# Altium project radxa_c200_io_board_v1.11.PrjPcb (part 3 of 8)

## Sheet 08_Fan Debug and EEPROM.SchDoc: C200
size 439 x 311 mm; Page Create Date: March  8, 1995; Page Number: 8; Page Size: Custom; Comment: radxa_1010; Page Count: 21; RevCode: V1.11; Doc: 08_Fan Debug and EEPROM; DsnPath: D:\WMS\C200\CC122\对外\C200 V1.11.DSN; SchematicName: c200; PageName: 08_Fan Debug and EEPROM; PageSize: Custom; TopSchematic: True
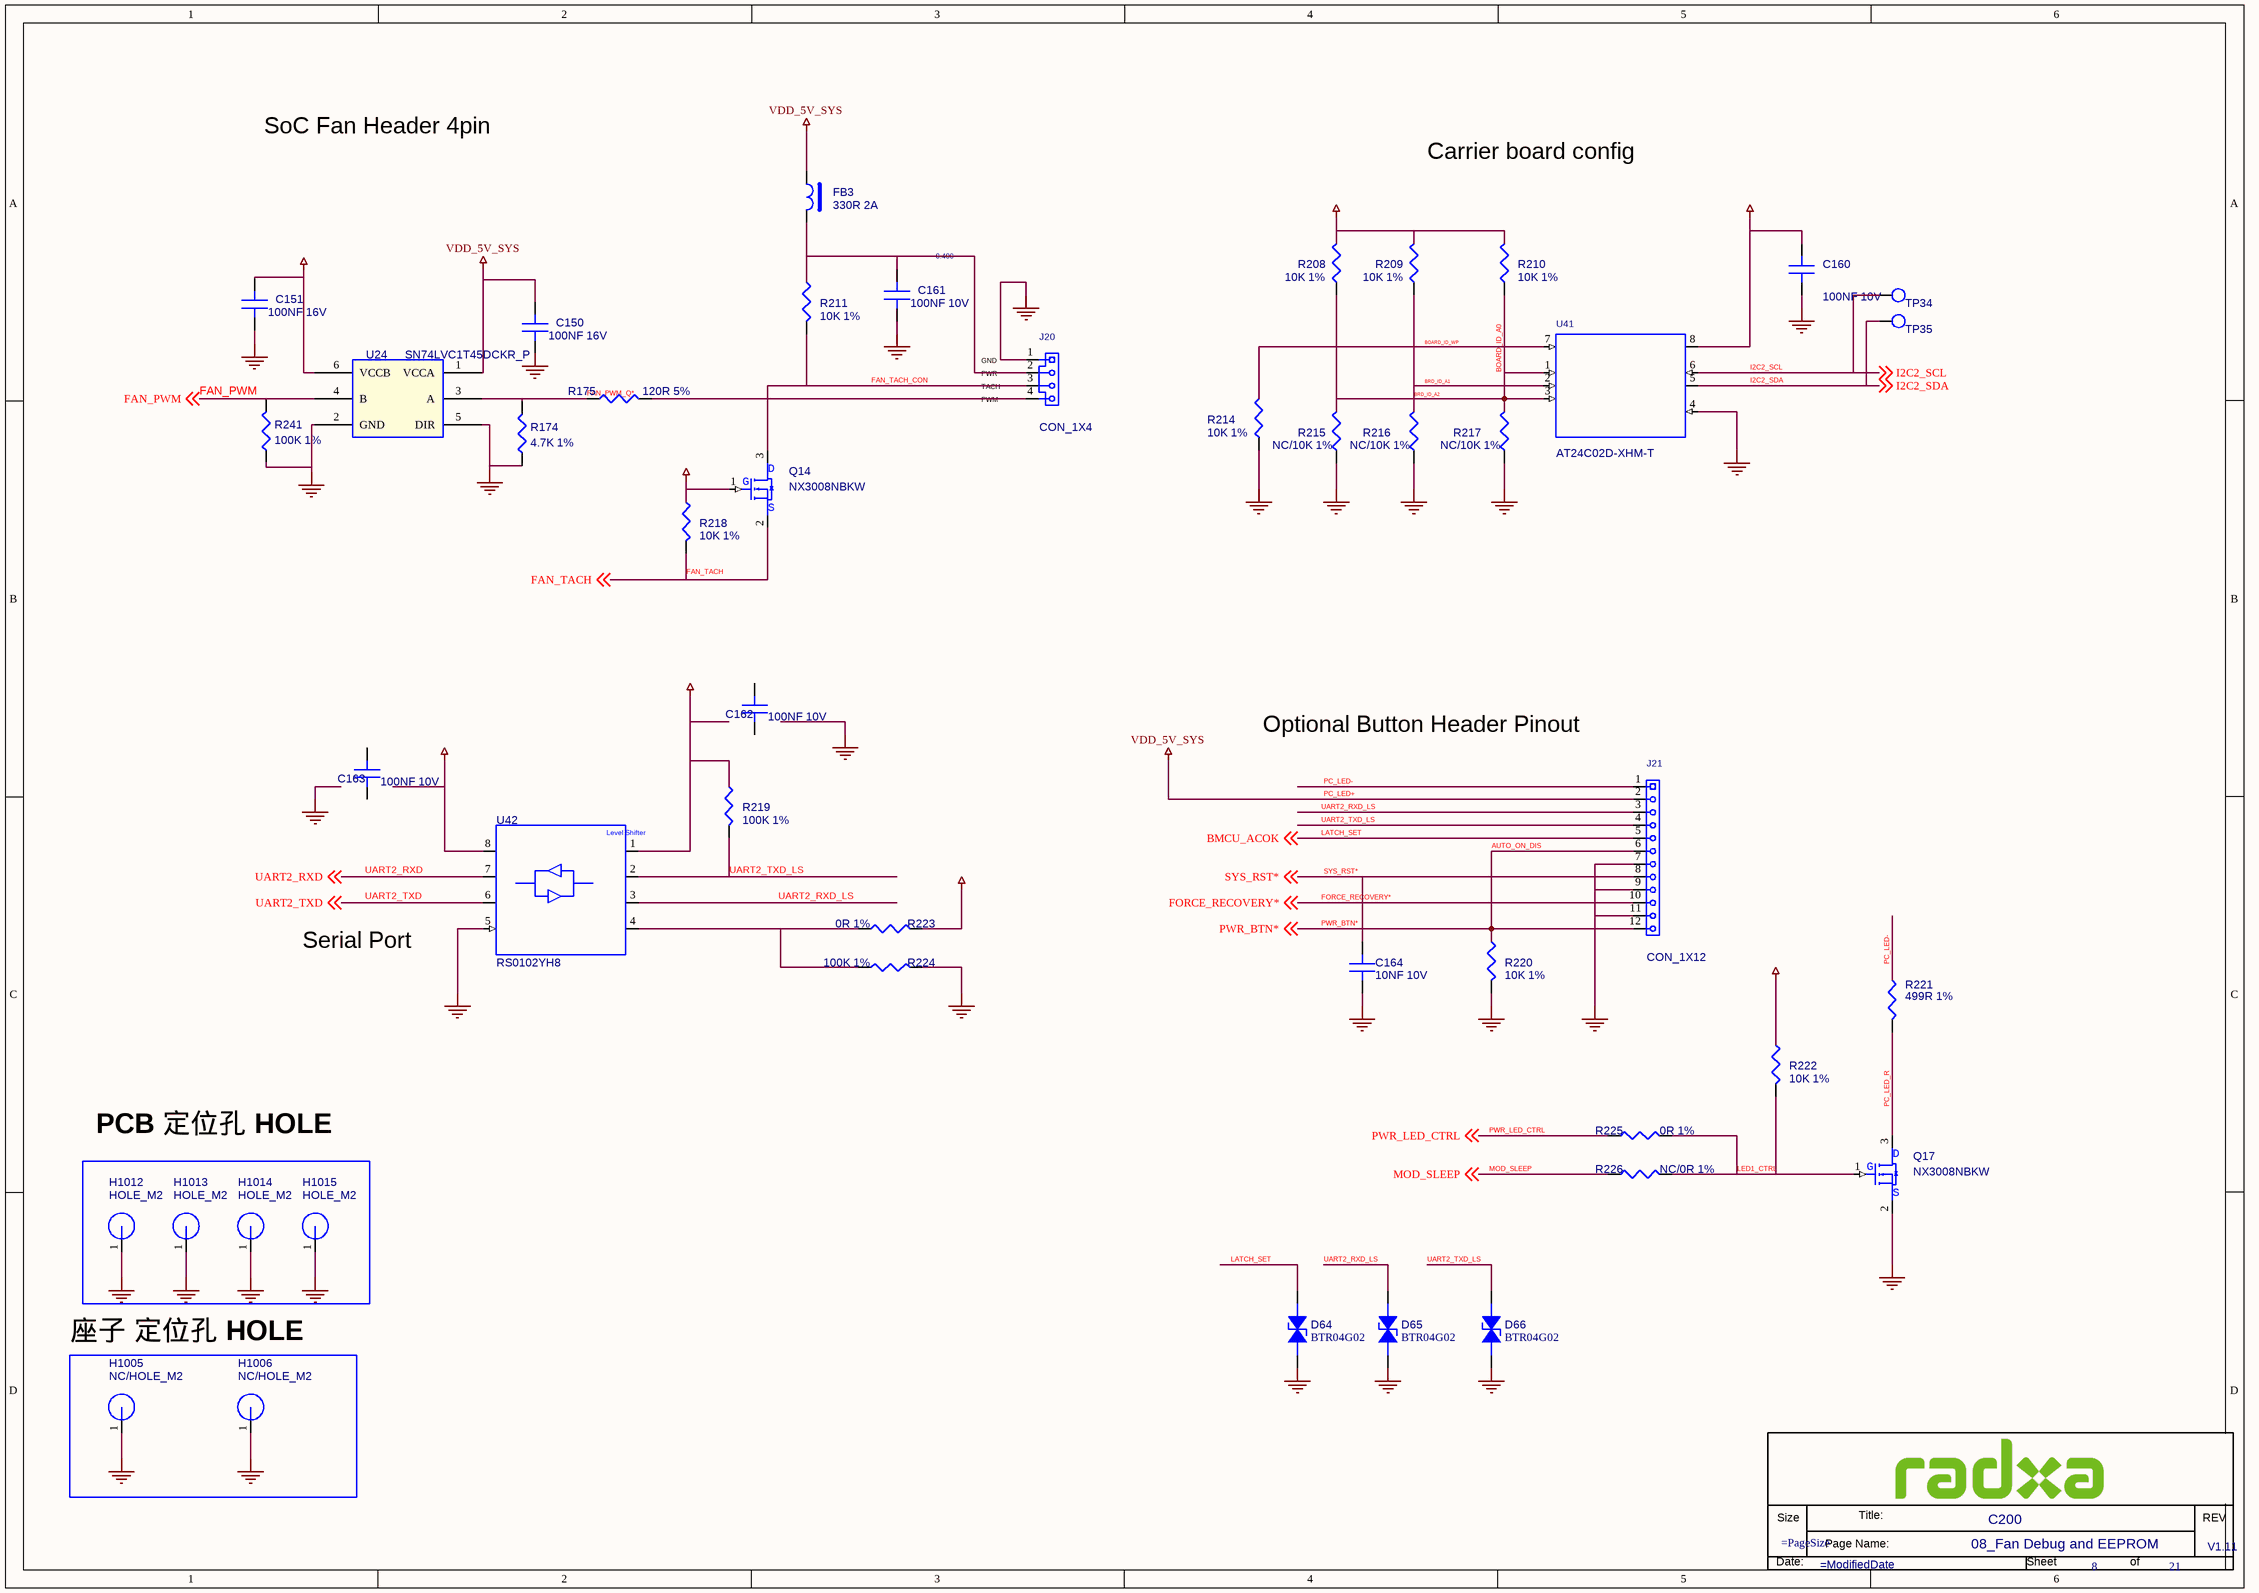
[diagram p17: 08_Fan Debug and EEPROM.SchDoc]

### Parts
(Parts that share a designator on the sheet are numbered #1, #2 ... from top to bottom, then left to right.)
*#7  Doc: 08_Fan Debug and EEPROM  RevCode: V1.11  Title: C200  Page Number: 8  Page Count: 21  (hidden comment: radxa_1010)  (graphical)
C150  100NF 16V  [C0201]
C151  100NF 16V  [C0201]
C160  100NF 10V  [C0402]
C161  100NF 10V  [C0402]
C162  100NF 10V  [C0402]
C163  100NF 10V  [C0402]
C164  10NF 10V  [C0201]
D64  BTR04G02  [DFN1006-2L]
D65  BTR04G02  [DFN1006-2L]
D66  BTR04G02  [DFN1006-2L]
FB3  330R 2A  [FB0603]
H1005  NC/HOLE_M2  [H3.8MM]
H1006  NC/HOLE_M2  [H3.8MM]
H1012  HOLE_M2  [H3.8MM]
H1013  HOLE_M2  [H3.8MM]
H1014  HOLE_M2  [H3.8MM]
H1015  HOLE_M2  [H3.8MM]
J20  CON_1X4  [CON_TH1X4_1D25_STA]
J21  CON_1X12  [CON_TH12X1_2D54_LIE]
Q14  NX3008NBKW  [SOT_323]
Q17  NX3008NBKW  [SOT_323]
R174  4.7K 1%  [R0402]
R175  120R 5%  [R0402]
R208  10K 1%  [R0402]
R209  10K 1%  [R0402]
R210  10K 1%  [R0402]
R211  10K 1%  [R0402]
R214  10K 1%  [R0402]
R215  NC/10K 1%  [R0402]
R216  NC/10K 1%  [R0402]
R217  NC/10K 1%  [R0402]
R218  10K 1%  [R0402]
R219  100K 1%  [R0402]
R220  10K 1%  [R0402]
R221  499R 1%  [R0402]
R222  10K 1%  [R0402]
R223  0R 1%  [R0402]
R224  100K 1%  [R0402]
R225  0R 1%  [R0402]
R226  NC/0R 1%  [R0402]
R241  100K 1%  [R0402]
TP34  DNI  [stp30]  (value not drawn)
TP35  DNI  [stp30]  (value not drawn)
U24  SN74LVC1T45DCKR_P  [SOT_363]
U41  AT24C02D-XHM-T  [DFN8_0D5_1D6]
U42  RS0102YH8  [SOT23_8]

### Blocks framed on the sheet
座子 定位孔 HOLE: H1005 H1006

### Nets
GND: C150.2(B) C151.2(B) C160.2(B) C161.2(B) C164.2(B) D64.1(ANODE) D65.1(ANODE) D66.1(ANODE) H1005.1 H1006.1 H1012.1 H1013.1 H1014.1 H1015.1 J20.1 J21.7 J21.9 J21.11 Q17.2(S) R174.1 R214.2 R215.2 R216.2 R217.2 R220.2 R224.1 R241.1 U24.2(GND) U24.5(DIR) U41.4(GND) U42.5(GND)  [project net HUB2_SSTX_N_J25]
PC_LED+: C150.1(A) FB3.1 J21.2 U24.1(VCCA)  [also labelled VDD_5V_SYS]
VDD_1V8: C151.1(A) C160.1(A) Q14.1(G) R208.1 R209.1 R210.1 R218.1 R222.1 R223.1 U24.6(VCCB) U41.8(VCC) U42.8(VCCA)
VDD_3V3_SYS: R219.1 U42.1(VCCB)  [project net 3V3]
AUTO_ON_DIS: J21.6 J21.12 R220.1 ; off-sheet PWR_BTN*  [also labelled PWR_BTN*]
BMCU_ACOK: D64.2(CATHODE) J21.5 ; off-sheet BMCU_ACOK  [also labelled LATCH_SET]
BOARD_ID_A0: R208.2 R209.2 R210.2 R215.1 R216.1 R217.1 U41.1(A0) U41.2(A1) U41.3(A2)  [also labelled BRD_ID_A1, BRD_ID_A2]
BOARD_ID_WP: R214.1 U41.7(WP)
FAN_PWM: R241.2 U24.4(B) ; off-sheet FAN_PWM
FAN_PWM_Q*: R174.2 R175.1 U24.3(A)
FAN_TACH: Q14.2(S) R218.2 ; off-sheet FAN_TACH
FAN_TACH_CON: J20.3 Q14.3(D) R211.2
FORCE_RECOVERY*: J21.10 ; off-sheet FORCE_RECOVERY*
I2C2_SCL: TP34.1 U41.6(SCL) ; off-sheet I2C2_SCL
I2C2_SDA: TP35.1 U41.5(SDA) ; off-sheet I2C2_SDA
LED1_CTRL: Q17.1(G) R222.2 R225.2 R226.2
MOD_SLEEP: R226.1 ; off-sheet MOD_SLEEP
PC_LED-: J21.1 R221.1
PC_LED_R: Q17.3(D) R221.2
PWR_LED_CTRL: R225.1 ; off-sheet PWR_LED_CTRL
SYS_RST*: C164.1(A) J21.8 ; off-sheet SYS_RST*
UART2_RXD: U42.7(A1) ; off-sheet UART2_RXD
UART2_RXD_LS: D65.2(CATHODE) J21.3 U42.3(B2)
UART2_TXD: U42.6(A2) ; off-sheet UART2_TXD
UART2_TXD_LS: D66.2(CATHODE) J21.4 R219.2 U42.2(B1)
NetC161_1: C161.1(A) FB3.2 J20.2 R211.1
NetJ20_4: J20.4 R175.2
NetR223_2: R223.2 R224.2 U42.4(OE)

Not connected (* = marked no-connect by the designer): C162 1(A) 2(B); C163 1(A) 2(B)

### Notes on the sheet
- SoC Fan Header 4pin
- Carrier board config
- (near C161) 0.400
- (near J20) PWR
- (near J20) GND
- (near J20) PWM
- (near J20) TACH
- Optional Button Header Pinout
- Serial Port
- PCB 定位孔 HOLE
- (in symbol radxa_1010) Size; Title:; REV; Page Name:; Date:; Sheet; of

### Library data of the parts
C150 = C: SMD  0201  100NF  16V  X5R  ±10%  ROHS; PARTS: 1; Part Reference: C150; Part Number: A1C01.00018; OriginalSymbolOrigin: (0,30); PKG_TYPE: CAP2-100-250; LEVEL: STD; PINSWAP: (A,B); Preferred: 6715f349cd0bc5; Value: 100NF 16V; Part Type: 陶瓷电容; PCB Footprint: C0201
C151 = C: SMD  0201  100NF  16V  X5R  ±10%  ROHS; PARTS: 1; Part Reference: C151; Part Number: A1C01.00018; OriginalSymbolOrigin: (0,30); PKG_TYPE: CAP2-100-250; LEVEL: STD; PINSWAP: (A,B); Preferred: 6715f349cd0bc5; Value: 100NF 16V; Part Type: 陶瓷电容; PCB Footprint: C0201
C160 = C: SMD  0402  100NF  10V  X5R  ±10%  ROHS; PARTS: 1; Part Reference: C160; Part Number: A1C01.00163; OriginalSymbolOrigin: (0,30); PKG_TYPE: CAP2-100-250; LEVEL: STD; PINSWAP: (A,B); Value: 100NF 10V; Part Type: 陶瓷电容; PCB Footprint: C0402
C161 = C: SMD  0402  100NF  10V  X5R  ±10%  ROHS; PARTS: 1; Part Reference: C161; Part Number: A1C01.00163; OriginalSymbolOrigin: (0,30); PKG_TYPE: CAP2-100-250; LEVEL: STD; PINSWAP: (A,B); Value: 100NF 10V; Part Type: 陶瓷电容; PCB Footprint: C0402
C162 = C: SMD  0402  100NF  10V  X5R  ±10%  ROHS; PARTS: 1; Part Reference: C162; CDS_PART_NAME: C_0402-0.1UF,X5R,10%,6.3V,039-0007-000; CDS_PHYS_PART_NAME: C_0402-0.1UF,X5R,10%,6.3V,039-0007-000-0.1UF,039-0007-000; Part Number: A1C01.00163; OriginalSymbolOrigin: (0,30); PKG_TYPE: CAP2-100-250; LEVEL: STD; PINSWAP: (A,B); ASSEMBLY: DEBUG; CDS_LIB: discrete; DEVICE_TYPENAME: C_0402-01UFX5R1063V039-0007-000-01UF039-0007-000; DRAWING: @P3449_B01_LIB.P3449_B01(SCH_1):PAGE20; MAX_VOLTAGE: 6.3V; NV_PN: 039-0007-000; PACK_TYPE: 402; PATH: I307; PHYS_PAGE: 20; ROT: 0; SIGNAL_MODEL: nv_cap; VER: 2; XY: (-8050,2950); Value: 100NF 10V; CDS_SEC: 1; CHIPS_PART_NAME: C; MAT: X5R; TOL: 10%; SEC: 1; Part Type: 陶瓷电容; PCB Footprint: C0402
C163 = C: SMD  0402  100NF  10V  X5R  ±10%  ROHS; PARTS: 1; Part Reference: C163; CDS_PART_NAME: C_0402-0.1UF,X5R,10%,6.3V,039-0007-000; CDS_PHYS_PART_NAME: C_0402-0.1UF,X5R,10%,6.3V,039-0007-000-0.1UF,039-0007-000; Part Number: A1C01.00163; OriginalSymbolOrigin: (0,30); PKG_TYPE: CAP2-100-250; LEVEL: STD; PINSWAP: (A,B); ASSEMBLY: DEBUG; CDS_LIB: discrete; DEVICE_TYPENAME: C_0402-01UFX5R1063V039-0007-000-01UF039-0007-000; DRAWING: @P3449_B01_LIB.P3449_B01(SCH_1):PAGE20; MAX_VOLTAGE: 6.3V; NV_PN: 039-0007-000; PACK_TYPE: 402; PATH: I309; PHYS_PAGE: 20; ROT: 0; SIGNAL_MODEL: nv_cap; VER: 2; XY: (-9550,2700); Value: 100NF 10V; CDS_SEC: 1; CHIPS_PART_NAME: C; MAT: X5R; TOL: 10%; SEC: 1; Part Type: 陶瓷电容; PCB Footprint: C0402
C164 = C: SMD  0201  10NF  10V  X5R  ±20%  ROHS; PARTS: 1; Part Reference: C164; Part Number: A1C01.00095; OriginalSymbolOrigin: (0,30); PKG_TYPE: CAP2-100-250; LEVEL: STD; PINSWAP: (A,B); Value: 10NF 10V; Part Type: 陶瓷电容; PCB Footprint: C0201
D64 = ESD: SMD  编带  0402  BTR04G02  B-tron  ROHS; Part Reference: D64; Part Number: A1D02.00002; Parameter: ESD-台舟 ESD5341N-封装 esd0402; ID: DE-E0004; Temp Coeff: -50℃ ~ +125℃; PCB Footprint: ESD_D0402; Value: BTR04G02; Part Type: 二极管-ESD管-桥堆-TVS管
D65 = ESD: SMD  编带  0402  BTR04G02  B-tron  ROHS; Part Reference: D65; Part Number: A1D02.00002; Parameter: ESD-台舟 ESD5341N-封装 esd0402; ID: DE-E0004; Temp Coeff: -50℃ ~ +125℃; PCB Footprint: ESD_D0402; Value: BTR04G02; Part Type: 二极管-ESD管-桥堆-TVS管
D66 = ESD: SMD  编带  0402  BTR04G02  B-tron  ROHS; Part Reference: D66; Part Number: A1D02.00002; Parameter: ESD-台舟 ESD5341N-封装 esd0402; ID: DE-E0004; Temp Coeff: -50℃ ~ +125℃; PCB Footprint: ESD_D0402; Value: BTR04G02; Part Type: 二极管-ESD管-桥堆-TVS管
FB3 = BEAD: SMD  0603  FB330R  2A  ±25%  ROHS; Part Reference: FB3; Part Number: A1L09.00023; PCB Footprint: FB0603; Value: 330R 2A; Part Type: 贴片磁珠
H1005 = HOLE: Part Reference: H1005; PCB Footprint: HOLE_C6_0D3_5MM; RK PN: HOLE_3R50; Priority: A; Value: NC/HOLE_M2; Part Type: HOLE
H1006 = HOLE: Part Reference: H1006; PCB Footprint: HOLE_C6_0D3_5MM; RK PN: HOLE_3R50; Priority: A; Value: NC/HOLE_M2; Part Type: HOLE
H1012 = HOLE: Part Reference: H1012; PCB Footprint: HOLE_C6_2D2_75MM; Priority: A; RK PN: HOLE_3R50; Value: HOLE_M2; Part Type: HOLE
H1013 = HOLE: Part Reference: H1013; PCB Footprint: HOLE_C6_2D2_75MM; Priority: A; RK PN: HOLE_3R50; Value: HOLE_M2; Part Type: HOLE
H1014 = HOLE: Part Reference: H1014; PCB Footprint: HOLE_C6_2D2_75MM; RK PN: HOLE_3R50; Priority: A; Value: HOLE_M2; Part Type: HOLE
H1015 = HOLE: Part Reference: H1015; PCB Footprint: HOLE_C6_2D2_75MM; RK PN: HOLE_3R50; Priority: A; Value: HOLE_M2; Part Type: HOLE
J20 = CON_1X4: DIP  母座  1*4PIN  90度  直脚  1.25mm脚距  5001-WF0125C-04P1-00  白色   文章济美  ROHS; Part Reference: J20; Part Number: A1J01.00077; OriginalSymbolOrigin: (-50,50); ANGLE: ?; ASSEMBLY: ?; GENDER: ?; LATCHING: ?; MAX_CURRENT: ?; MAX_VOLTAGE: ?; NV_NAME: ?; NV_PN: ?; PACK_TYPE: ?; PATH: ?; PITCH: ?; PLACEMENT_NOTE: ?; REFLOW: ?; SHROUDED: ?; SKU: COMMON; Value: CON_1X4; Part Type: 连接座; PCB Footprint: CON_TH1X4_1D25_STA
J21 = CON_1X12: DIP  排针座  1*12PIN  90度  弯角  2.54mm脚距  L=13.8/3.0(1.2)/6.0  PA6T  国意英  ROHS; Part Reference: J21; Part Number: A1J02.00035; OriginalSymbolOrigin: (0,300); ANGLE: ?; ASSEMBLY: ?; GENDER: ?; LATCHING: ?; MAX_CURRENT: ?; MAX_VOLTAGE: ?; NV_NAME: ?; NV_PN: ?; PACK_TYPE: ?; PATH: ?; PITCH: ?; PLACEMENT_NOTE: ?; REFLOW: ?; SHROUDED: ?; SKU: COMMON; Value: CON_1X12; Part Type: 排座; PCB Footprint: CON_TH12X1_2D54_LIE
Q14 = MOSFET_NPN: SMD  编带  SOT-323  NX3008NBKW  N沟道  Nexperia(安世)  ROHS; Part Reference: Q14; Part Number: A1D01.00070; Temp Coeff: -55℃ to ＋150℃; Value: NX3008NBKW; Part Type: 三极管-MOS管; PCB Footprint: SOT_323
Q17 = MOSFET_NPN: SMD  编带  SOT-323  NX3008NBKW  N沟道  Nexperia(安世)  ROHS; Part Reference: Q17; Part Number: A1D01.00070; Temp Coeff: -55℃ to ＋150℃; Value: NX3008NBKW; Part Type: 三极管-MOS管; PCB Footprint: SOT_323
R174 = R: SMD  0201  4.7K  1/20W  ±1%  ROHS; Part Reference: R174; Part Number: A1R01.00148; PCB Footprint: R0201; Preferred: 6715f349cd0bc5; Value: 4.7K 1%; Part Type: 贴片电阻
R175 = R: SMD  0402  120R  1/16W  ±5%  ROHS; Part Reference: R175; Part Number: A1R01.00275; Preferred: 6715f349cd0bc5; PCB Footprint: R0402; Value: 120R 5%; Part Type: 贴片电阻
R208 = R: SMD  0402  10K  1/16W  ±1%  ROHS; Part Reference: R208; CDS_PART_NAME: R_0402-10K,5 %,62.5MW,195-0486-000; CDS_PHYS_PART_NAME: R_0402-10K,5 %,62.5MW,195-0486-000-10K,195-0486-000; Part Number: A1R01.00222; ASSEMBLY: L4T_EEPROM; CDS_LIB: discrete; CDS_SEC: 1; DEVICE_TYPENAME: R_0402-10K5625MW195-0486-000-10K195-0486-000; DRAWING: @P3449_B01_LIB.P3449_B01(SCH_1):PAGE20; MAX_WATTAGE: 62.5mW; NV_PN: 195-0486-000; PACK_TYPE: 402; PATH: I346; PHYS_PAGE: 20; ROT: 2; SIGNAL_MODEL: nv_res; TOL: 5%; XY: (-4100,6200); PCB Footprint: R0402; Value: 10K 1%; CHIPS_PART_NAME: R; SEC_TYPE: 402; VER: 2; SEC: 1; Part Type: 贴片电阻
R209 = R: SMD  0402  10K  1/16W  ±1%  ROHS; Part Reference: R209; CDS_PART_NAME: R_0402-10K,5 %,62.5MW,195-0486-000; CDS_PHYS_PART_NAME: R_0402-10K,5 %,62.5MW,195-0486-000-10K,195-0486-000; Part Number: A1R01.00222; ASSEMBLY: L4T_EEPROM; CDS_LIB: discrete; CDS_SEC: 1; DEVICE_TYPENAME: R_0402-10K5625MW195-0486-000-10K195-0486-000; DRAWING: @P3449_B01_LIB.P3449_B01(SCH_1):PAGE20; MAX_WATTAGE: 62.5mW; NV_PN: 195-0486-000; PACK_TYPE: 402; PATH: I344; PHYS_PAGE: 20; ROT: 2; SIGNAL_MODEL: nv_res; TOL: 5%; XY: (-3800,6200); PCB Footprint: R0402; Value: 10K 1%; CHIPS_PART_NAME: R; SEC_TYPE: 402; VER: 2; SEC: 1; Part Type: 贴片电阻
R210 = R: SMD  0402  10K  1/16W  ±1%  ROHS; Part Reference: R210; Part Number: A1R01.00222; CDS_PHYS_PART_NAME: R_0402-10K,5 %,62.5MW,195-0486-000-10K,195-0486-000; CDS_PART_NAME: R_0402-10K,5 %,62.5MW,195-0486-000; SEC: 1; XY: (-3450,6200); VER: 2; TOL: 5%; SIGNAL_MODEL: nv_res; SEC_TYPE: 402; PHYS_PAGE: 20; PATH: I343; NV_PN: 195-0486-000; MAX_WATTAGE: 62.5mW; DRAWING: @P3449_B01_LIB.P3449_B01(SCH_1):PAGE20; DEVICE_TYPENAME: R_0402-10K5625MW195-0486-000-10K195-0486-000; CDS_LIB: discrete; ASSEMBLY: L4T_EEPROM; PCB Footprint: R0402; Value: 10K 1%; Part Type: 贴片电阻; ROT: 2; PACK_TYPE: 402; CHIPS_PART_NAME: R; CDS_SEC: 1
R211 = R: SMD  0402  10K  1/16W  ±1%  ROHS; Part Reference: R211; CDS_PART_NAME: R_0402-10K,5 %,62.5MW,195-0486-000; CDS_PHYS_PART_NAME: R_0402-10K,5 %,62.5MW,195-0486-000-10K,195-0486-000; Part Number: A1R01.00222; ASSEMBLY: FAN; CDS_LIB: discrete; CDS_SEC: 1; DEVICE_TYPENAME: R_0402-10K5625MW195-0486-000-10K195-0486-000; DRAWING: @P3449_B01_LIB.P3449_B01(SCH_1):PAGE20; MAX_WATTAGE: 62.5mW; NV_PN: 195-0486-000; PACK_TYPE: 402; PATH: I372; PHYS_PAGE: 20; ROT: 0; SIGNAL_MODEL: nv_res; TOL: 5%; VER: 2; XY: (-8350,5950); PCB Footprint: R0402; Value: 10K 1%; CHIPS_PART_NAME: R; SEC: 1; Part Type: 贴片电阻
R214 = R: SMD  0402  10K  1/16W  ±1%  ROHS; Part Reference: R214; CDS_PART_NAME: R_0402-10K,5 %,62.5MW,195-0486-000; CDS_PHYS_PART_NAME: R_0402-10K,5 %,62.5MW,195-0486-000-10K,195-0486-000; Part Number: A1R01.00222; ASSEMBLY: L4T_EEPROM; CDS_LIB: discrete; CDS_SEC: 1; DEVICE_TYPENAME: R_0402-10K5625MW195-0486-000-10K195-0486-000; DRAWING: @P3449_B01_LIB.P3449_B01(SCH_1):PAGE20; MAX_WATTAGE: 62.5mW; NV_PN: 195-0486-000; PACK_TYPE: 402; PATH: I350; PHYS_PAGE: 20; ROT: 2; SIGNAL_MODEL: nv_res; TOL: 5%; XY: (-4400,5600); PCB Footprint: R0402; Value: 10K 1%; CHIPS_PART_NAME: R; SEC_TYPE: 402; VER: 2; SEC: 1; Part Type: 贴片电阻
R215 = R: SMD  0402  10K  1/16W  ±1%  ROHS; Part Reference: R215; Part Number: A1R01.00222; CDS_PHYS_PART_NAME: R_0402-10K,5 %,62.5MW,195-0486-000-10K,195-0486-000; CDS_PART_NAME: R_0402-10K,5 %,62.5MW,195-0486-000; SEC: 1; XY: (-4100,5550); VER: 2; TOL: 5%; SIGNAL_MODEL: nv_res; PHYS_PAGE: 20; PATH: I375; PACK_TYPE: 402; NV_PN: 195-0486-000; MAX_WATTAGE: 62.5mW; DRAWING: @P3449_B01_LIB.P3449_B01(SCH_1):PAGE20; DEVICE_TYPENAME: R_0402-10K5625MW195-0486-000-10K195-0486-000; CDS_LIB: discrete; ASSEMBLY: L4T_EEPROM; PCB Footprint: R0402; Value: NC/10K 1%; Part Type: 贴片电阻; SKU: NO STUFF; ROT: 2; CHIPS_PART_NAME: R; CDS_SEC: 1
R216 = R: SMD  0402  10K  1/16W  ±1%  ROHS; Part Reference: R216; Part Number: A1R01.00222; CDS_PHYS_PART_NAME: R_0402-10K,5 %,62.5MW,195-0486-000-10K,195-0486-000; CDS_PART_NAME: R_0402-10K,5 %,62.5MW,195-0486-000; SEC: 1; XY: (-3800,5550); VER: 2; TOL: 5%; SIGNAL_MODEL: nv_res; PHYS_PAGE: 20; PATH: I374; PACK_TYPE: 402; NV_PN: 195-0486-000; MAX_WATTAGE: 62.5mW; DRAWING: @P3449_B01_LIB.P3449_B01(SCH_1):PAGE20; DEVICE_TYPENAME: R_0402-10K5625MW195-0486-000-10K195-0486-000; CDS_LIB: discrete; ASSEMBLY: L4T_EEPROM; PCB Footprint: R0402; Value: NC/10K 1%; Part Type: 贴片电阻; SKU: NO STUFF; ROT: 2; CHIPS_PART_NAME: R; CDS_SEC: 1
R217 = R: SMD  0402  10K  1/16W  ±1%  ROHS; Part Reference: R217; Part Number: A1R01.00222; CDS_PHYS_PART_NAME: R_0402-10K,5 %,62.5MW,195-0486-000-10K,195-0486-000; CDS_PART_NAME: R_0402-10K,5 %,62.5MW,195-0486-000; SEC: 1; XY: (-3450,5550); VER: 2; TOL: 5%; SIGNAL_MODEL: nv_res; SEC_TYPE: 402; PHYS_PAGE: 20; PATH: I348; NV_PN: 195-0486-000; MAX_WATTAGE: 62.5mW; DRAWING: @P3449_B01_LIB.P3449_B01(SCH_1):PAGE20; DEVICE_TYPENAME: R_0402-10K5625MW195-0486-000-10K195-0486-000; CDS_LIB: discrete; ASSEMBLY: L4T_EEPROM; PCB Footprint: R0402; Value: NC/10K 1%; Part Type: 贴片电阻; SKU: NO STUFF; ROT: 2; PACK_TYPE: 402; CHIPS_PART_NAME: R; CDS_SEC: 1
R218 = R: SMD  0402  10K  1/16W  ±1%  ROHS; Part Reference: R218; Part Number: A1R01.00222; CDS_PHYS_PART_NAME: R_0402-10K,5 %,62.5MW,195-0486-000-10K,195-0486-000; CDS_PART_NAME: R_0402-10K,5 %,62.5MW,195-0486-000; SEC: 1; XY: (-9150,4600); VER: 2; TOL: 5%; SIGNAL_MODEL: nv_res; ROT: 0; PHYS_PAGE: 20; PATH: I370; PACK_TYPE: 402; NV_PN: 195-0486-000; MAX_WATTAGE: 62.5mW; DRAWING: @P3449_B01_LIB.P3449_B01(SCH_1):PAGE20; DEVICE_TYPENAME: R_0402-10K5625MW195-0486-000-10K195-0486-000; CDS_LIB: discrete; ASSEMBLY: FAN; PCB Footprint: R0402; Value: 10K 1%; Part Type: 贴片电阻; CHIPS_PART_NAME: R; CDS_SEC: 1
R219 = R: SMD  0402  100K  1/16W  ±1%  ROHS; Part Reference: R219; Part Number: A1R01.00031; CDS_PHYS_PART_NAME: R_0402-100K,1 %,62.5MW,195-0005-000-100K,195-0005-000; CDS_PART_NAME: R_0402-100K,1 %,62.5MW,195-0005-000; Temp Coeff: －55℃ ~ ＋155℃; SEC: 1; XY: (-8150,2600); VER: 2; SIGNAL_MODEL: nv_res; ROT: 0; PHYS_PAGE: 20; PATH: I367; PACK_TYPE: 402; NV_PN: 195-0005-000; MAX_WATTAGE: 62.5mW; DRAWING: @P3449_B01_LIB.P3449_B01(SCH_1):PAGE20; DEVICE_TYPENAME: R_0402-100K1625MW195-0005-000-100K195-0005-000; CDS_LIB: discrete; ASSEMBLY: DEBUG; PCB Footprint: R0402; Value: 100K 1%; Part Type: 贴片电阻; TOL: 1%; CHIPS_PART_NAME: R; CDS_SEC: 1
R220 = R: SMD  0402  10K  1/16W  ±1%  ROHS; Part Reference: R220; Part Number: A1R01.00222; CDS_PART_NAME: R_0402-10K,5 %,62.5MW,195-0486-000; CDS_PHYS_PART_NAME: R_0402-10K,5 %,62.5MW,195-0486-000-10K,195-0486-000; ASSEMBLY: AUTOMATION; CDS_LIB: discrete; CDS_SEC: 1; DEVICE_TYPENAME: R_0402-10K5625MW195-0486-000-10K195-0486-000; DRAWING: #NAME?; MAX_WATTAGE: 62.5mW; NV_PN: 195-0486-000; PACK_TYPE: 402; PATH: I97; PHYS_PAGE: 23; ROT: 0; SIGNAL_MODEL: nv_res; TOL: 5%; VER: 2; XY: (-3000,2800); PCB Footprint: R0402; Value: 10K 1%; Part Type: 贴片电阻; CHIPS_PART_NAME: R; SEC: 1
R221 = R: SMD  0402  499R  1/16W  ±1%  ROHS; Part Reference: R221; Part Number: A1R01.00308; CDS_PART_NAME: R_0402-499OHM,1 %,62.5MW,195-0338-000; CDS_PHYS_PART_NAME: R_0402-499OHM,1 %,62.5MW,195-0338-000-195-0338-000,499OHM; ASSEMBLY: AUTOMATION; CDS_LIB: discrete; CDS_SEC: 1; DEVICE_TYPENAME: R_0402-499OHM1625MW195-0338-000-195-0338-000499OHM; DRAWING: @P3449_B01_LIB.P3449_B01(SCH_1):PAGE20; MAX_WATTAGE: 62.5mW; NV_PN: 195-0338-000; PACK_TYPE: 402; PATH: I420; PHYS_PAGE: 20; ROT: 0; SIGNAL_MODEL: nv_res; VER: 2; XY: (-1150,2750); PCB Footprint: R0402; Value: 499R 1%; Part Type: 贴片电阻; CHIPS_PART_NAME: R; TOL: 1%; SEC: 1
R222 = R: SMD  0402  10K  1/16W  ±1%  ROHS; Part Reference: R222; Part Number: A1R01.00222; CDS_PART_NAME: R_0402-10K,5 %,62.5MW,195-0486-000; CDS_PHYS_PART_NAME: R_0402-10K,5 %,62.5MW,195-0486-000-10K,195-0486-000; ASSEMBLY: AUTOMATION; CDS_LIB: discrete; CDS_SEC: 1; DEVICE_TYPENAME: R_0402-10K5625MW195-0486-000-10K195-0486-000; DRAWING: @P3449_B01_LIB.P3449_B01(SCH_1):PAGE20; MAX_WATTAGE: 62.5mW; NV_PN: 195-0486-000; PACK_TYPE: 402; PATH: I430; PHYS_PAGE: 20; ROT: 0; SIGNAL_MODEL: nv_res; TOL: 5%; VER: 2; XY: (-1600,2500); PCB Footprint: R0402; Value: 10K 1%; Part Type: 贴片电阻; CHIPS_PART_NAME: R; SEC: 1
R223 = R: SMD  0402  0R  1/16W  ±1%  ROHS; Part Reference: R223; Part Number: A1R01.00219; PCB Footprint: R0402; Value: 0R 1%; Part Type: 贴片电阻
R224 = R: SMD  0402  100K  1/16W  ±1%  ROHS; Part Reference: R224; Part Number: A1R01.00031; Temp Coeff: －55℃ ~ ＋155℃; PCB Footprint: R0402; Value: 100K 1%; Part Type: 贴片电阻
R225 = R: SMD  0402  0R  1/16W  ±1%  ROHS; Part Reference: R225; Part Number: A1R01.00219; PCB Footprint: R0402; Value: 0R 1%; Part Type: 贴片电阻
R226 = R: SMD  0402  0R  1/16W  ±1%  ROHS; Part Reference: R226; Part Number: A1R01.00219; PCB Footprint: R0402; Value: NC/0R 1%; Part Type: 贴片电阻
R241 = R: SMD  0201  100K  1/20W  ±1%  ROHS; Part Reference: R241; Part Number: A1R01.00165; PCB Footprint: R0201; Preferred: 6715f349cd0bc5; Value: 100K 1%; Part Type: 贴片电阻
TP34 = TP: Part Reference: TP34; partnumber: NC_00025; MFRName: NA; Parameter: 测试点; PCB Footprint: TP32; Price: 0.00000; partType: NC; MFRPN: NA; Height: 0
TP35 = TP: Part Reference: TP35; MFRPN: NA; partnumber: NC_00025; Parameter: 测试点; PCB Footprint: TP32; Height: 0; MFRName: NA; partType: NC; Price: 0.00000
U24 = SN74LVC1T45DCKR_P: SMD  电平转换  SN74LVC1T45DCKR-P  SOT363  TI(德州仪器)  ROHS; Part Reference: U24; Part Number: A1I01.00003; Preferred: 6715f349cd0bc5; Temp Coeff: -40℃ to +85℃; Value: SN74LVC1T45DCKR_P; Part Type: 集成电路/模块; PCB Footprint: SOT_363
U41 = BL34C04A_NTRC: SMD  EEPROM  AT24C02D-XHM-T美)  ROHS; Part Reference: U41; Part Number: A1I01.00594; OriginalSymbolOrigin: (-250,200); PCB Footprint: TSSOP8_0D65_4; SPEED_GRADE: ?; SKU: COMMON; POW: ?; PLACEMENT_NOTE: ?; PATH: ?; PACK_TYPE: ?; NV_PN: ?; NV_NAME: ?; ASSEMBLY: ?; Value: AT24C02D-XHM-T; Part Type: 集成电路/模块
U42 = RS0102YH8: SMD  电平转换  RS0102YH8  SOT23-8  润石  ROHS; Part Reference: U42; CHIPS_PART_NAME: U_LEVSHFT_TXB0302; CDS_PHYS_PART_NAME: U_LEVSHFT_TXB0302_DFN8-TXB0302DQMR,LEVEL SHIFTER,115-2177-000-115-2177-000; CDS_PART_NAME: U_LEVSHFT_TXB0302_DFN8-TXB0302DQMR,LEVEL SHIFTER,115-2177-000; Part Number: A1I01.00231; ASSEMBLY: DEBUG; FUNCTION: Level Shifter; NV_NAME: UM3202Q; NV_PN: 115-2177-000; PACK_TYPE: DFN8; PATH: I365; OriginalSymbolOrigin: (-250,250); SEC: 1; XY: (-8800,2300); ROT: 0; PHYS_PAGE: 20; DRAWING: @P3449_B01_LIB.P3449_B01(SCH_1):PAGE20; DEVICE_TYPENAME: U_LEVSHFT_TXB0302_DFN8-TXB0302DQMRLEVELSHIFTER115-2177-000-115-2177-000; CDS_LIB: logic; PLACEMENT_NOTE: ?; SKU: COMMON; Value: RS0102YH8; VER: 1; CDS_SEC: 1; Part Type: 集成电路/模块; PCB Footprint: SOT23_8
*#7 = radxa_1010: Page Create Date: March  8, 1995; Page Size: =PageSize; Page Modify Date: =ModifiedDate

## Sheet 09_1V8 LDO & 3V3 AO Rails.SchDoc: C200
size 297 x 209 mm; Page Create Date: March  8, 1995; Page Number: 9; Page Size: A4; Comment: radxa_1010; Page Count: 21; RevCode: V1.11; Doc: 09_1V8 LDO & 3V3 AO Rails; DsnPath: D:\WMS\C200\CC122\对外\C200 V1.11.DSN; SchematicName: c200; PageName: 09_1V8 LDO & 3V3 AO Rails; PageSize: A4; TopSchematic: True
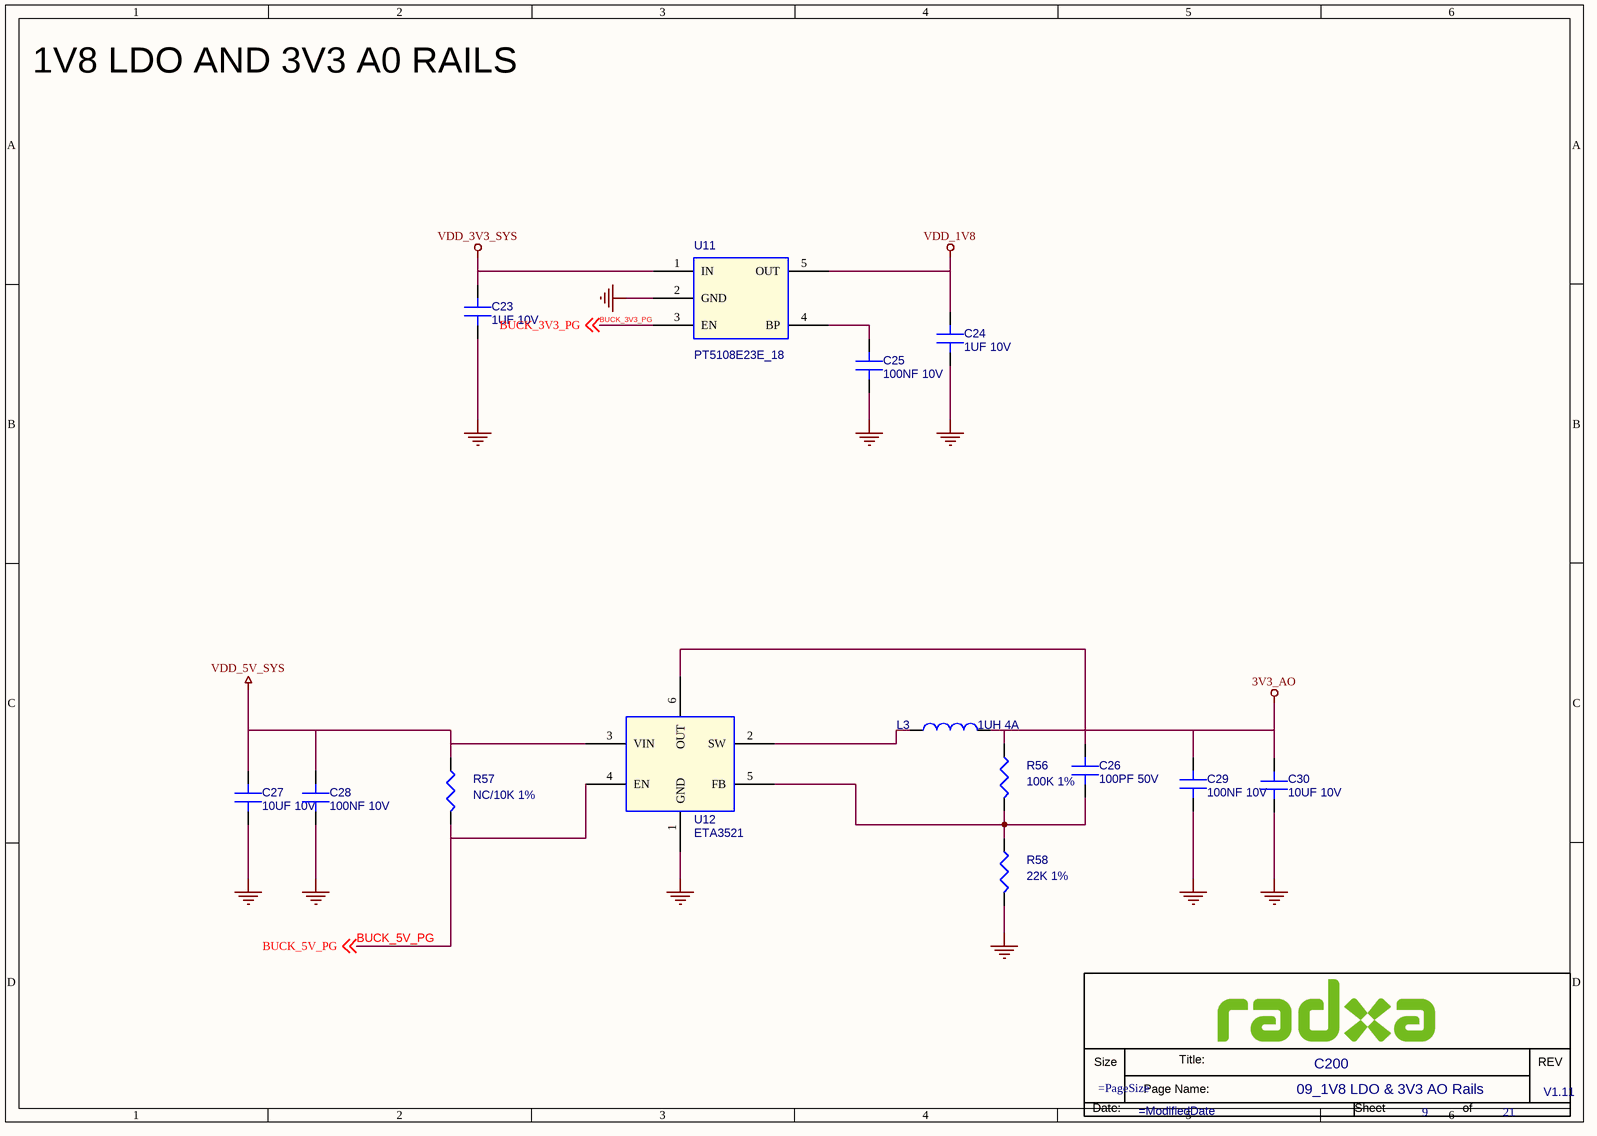
[diagram p18: 09_1V8 LDO & 3V3 AO Rails.SchDoc]

### Parts
(Parts that share a designator on the sheet are numbered #1, #2 ... from top to bottom, then left to right.)
*#8  Doc: 09_1V8 LDO & 3V3 AO Rails  RevCode: V1.11  Title: C200  Page Number: 9  Page Count: 21  (hidden comment: radxa_1010)  (graphical)
C23  1UF 10V  [C0402]
C24  1UF 10V  [C0402]
C25  100NF 10V  [C0402]
C26  100PF 50V  [C0402]
C27  10UF 10V  [C0603]
C28  100NF 10V  [C0402]
C29  100NF 10V  [C0402]
C30  10UF 10V  [C0603]
L3  1UH 4A  [L_2016]
R56  100K 1%  [R0402]
R57  NC/10K 1%  [R0402]
R58  22K 1%  [R0402]
U11  PT5108E23E_18  [SOT23_5]
U12  ETA3521  [SOT563]

### Nets
3V3_AO: C26.1(A) C29.1(A) C30.1(A) L3.2 R56.1 U12.6(OUT)
GND: C23.2(B) C24.2(B) C25.2(B) C27.2(B) C28.2(B) C29.2(B) C30.2(B) R58.2 U11.2(GND) U12.1(GND)  [project net HUB2_SSTX_N_J25]
VDD_1V8: C24.1(A) U11.5(OUT)
VDD_3V3_SYS: C23.1(A) U11.1(IN)  [project net 3V3]
VDD_5V_SYS: C27.1(A) C28.1(A) R57.1 U12.3(VIN)  [project net PC_LED+]
BUCK_3V3_PG: U11.3(EN) ; off-sheet BUCK_3V3_PG
BUCK_5V_PG: R57.2 U12.4(EN) ; off-sheet BUCK_5V_PG
NetC25_1: C25.1(A) U11.4(BP)
NetC26_2: C26.2(B) R56.2 R58.1 U12.5(FB)
NetL3_1: L3.1 U12.2(SW)

### Notes on the sheet
- 1V8 LDO AND 3V3 A0 RAILS
- (in symbol radxa_1010) Size; Title:; REV; Page Name:; Date:; Sheet; of

### Library data of the parts
C23 = C: SMD  0402  1UF  10V  X5R  ±10%  ROHS; PARTS: 1; Part Reference: C23; Part Number: A1C01.00063; OriginalSymbolOrigin: (0,30); PKG_TYPE: CAP2-100-250; LEVEL: STD; PINSWAP: (A,B); Value: 1UF 10V; Part Type: 陶瓷电容; PCB Footprint: C0402
C24 = C: SMD  0402  1UF  10V  X5R  ±10%  ROHS; PARTS: 1; Part Reference: C24; Part Number: A1C01.00063; OriginalSymbolOrigin: (0,30); PKG_TYPE: CAP2-100-250; LEVEL: STD; PINSWAP: (A,B); Value: 1UF 10V; Part Type: 陶瓷电容; PCB Footprint: C0402
C25 = C: SMD  0402  100NF  10V  X5R  ±10%  ROHS; PARTS: 1; Part Reference: C25; Part Number: A1C01.00163; OriginalSymbolOrigin: (0,30); PKG_TYPE: CAP2-100-250; LEVEL: STD; PINSWAP: (A,B); Value: 100NF 10V; Part Type: 陶瓷电容; PCB Footprint: C0402
C26 = C: SMD  0402  100PF  50V  NPO  ±5%  ROHS; PARTS: 1; Part Reference: C26; Part Number: A1C01.00156; OriginalSymbolOrigin: (0,30); PKG_TYPE: CAP2-100-250; LEVEL: STD; PINSWAP: (A,B); Value: 100PF 50V; Part Type: 陶瓷电容; PCB Footprint: C0402
C27 = C: SMD  0603  10UF  10V  X5R  ±10%  ROHS; PARTS: 1; Part Reference: C27; Part Number: A1C01.00270; OriginalSymbolOrigin: (0,30); PKG_TYPE: CAP2-100-250; LEVEL: STD; PINSWAP: (A,B); Value: 10UF 10V; Part Type: 陶瓷电容; PCB Footprint: C0603
C28 = C: SMD  0402  100NF  10V  X5R  ±10%  ROHS; PARTS: 1; Part Reference: C28; Part Number: A1C01.00163; OriginalSymbolOrigin: (0,30); PKG_TYPE: CAP2-100-250; LEVEL: STD; PINSWAP: (A,B); Value: 100NF 10V; Part Type: 陶瓷电容; PCB Footprint: C0402
C29 = C: SMD  0402  100NF  10V  X5R  ±10%  ROHS; PARTS: 1; Part Reference: C29; Part Number: A1C01.00163; OriginalSymbolOrigin: (0,30); PKG_TYPE: CAP2-100-250; LEVEL: STD; PINSWAP: (A,B); Value: 100NF 10V; Part Type: 陶瓷电容; PCB Footprint: C0402
C30 = C: SMD  0603  10UF  10V  X5R  ±10%  ROHS; PARTS: 1; Part Reference: C30; Part Number: A1C01.00270; OriginalSymbolOrigin: (0,30); PKG_TYPE: CAP2-100-250; LEVEL: STD; PINSWAP: (A,B); Value: 10UF 10V; Part Type: 陶瓷电容; PCB Footprint: C0603
L3 = L: SMD  带屏蔽  2*1.6*1.0mm  1UH  4A  ±20%  RHP201610T-1R0MT  仁芯微  ROHS; Part Reference: L3; Part Number: A1L01.00125; Temp Coeff: -55℃ to +125℃; PCB Footprint: L_2016; Value: 1UH 4A; Part Type: 贴片功率电感
R56 = R: SMD  0402  100K  1/16W  ±1%  ROHS; Part Reference: R56; Part Number: A1R01.00031; Temp Coeff: －55℃ ~ ＋155℃; PCB Footprint: R0402; Value: 100K 1%; Part Type: 贴片电阻
R57 = R: SMD  0402  10K  1/16W  ±1%  ROHS; Part Reference: R57; Part Number: A1R01.00222; PCB Footprint: R0402; Value: NC/10K 1%; Part Type: 贴片电阻
R58 = R: SMD  0402  22K  1/16W  ±1%  ROHS; Part Reference: R58; Part Number: A1R01.00083; PCB Footprint: R0402; Value: 22K 1%; Part Type: 贴片电阻
U11 = PT5108E23E_18: SMD  LDO，固定输出1.8V  PT5108E23E-18  SOT23-5  Powtech  ROHS; Part Reference: U11; Part Number: A1I01.00016; PCB Footprint: SOT23_5; Value: PT5108E23E_18; Part Type: 集成电路/模块
U12 = ETA3521: SMD  降压型DCDC,2MHz, 4A  ETA3521  SOT563  钰泰  ROHS; Part Reference: U12; Part Number: A1I01.00040; Value: ETA3521; Part Type: 集成电路/模块; PCB Footprint: SOT563
*#8 = radxa_1010: Page Create Date: March  8, 1995; Page Size: =PageSize; Page Modify Date: =ModifiedDate

## Sheet 10_TYPE_C.SchDoc: C200
size 594 x 420 mm; Page Create Date: March  8, 1995; Page Number: 10; Page Size: A2; Comment: radxa_1010; Page Count: 21; RevCode: V1.11; Doc: 10_TYPE_C; DsnPath: D:\WMS\C200\CC122\对外\C200 V1.11.DSN; SchematicName: c200; PageName: 10_TYPE_C; PageSize: A2; TopSchematic: True
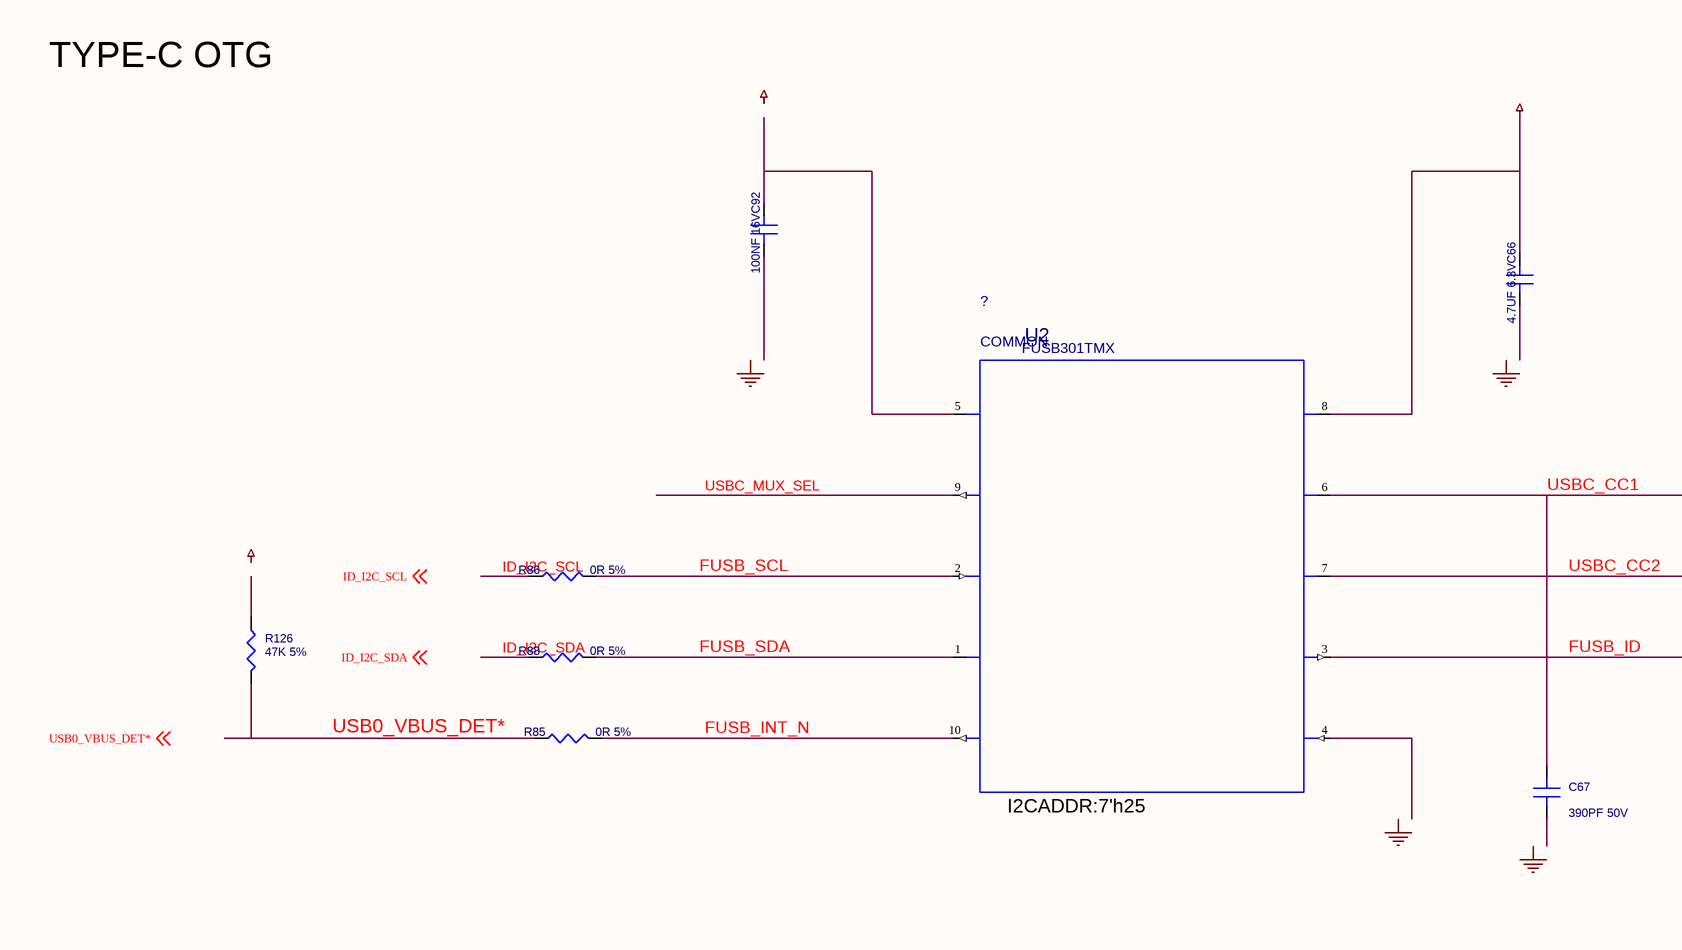
[diagram p19: 10_TYPE_C.SchDoc, top left]
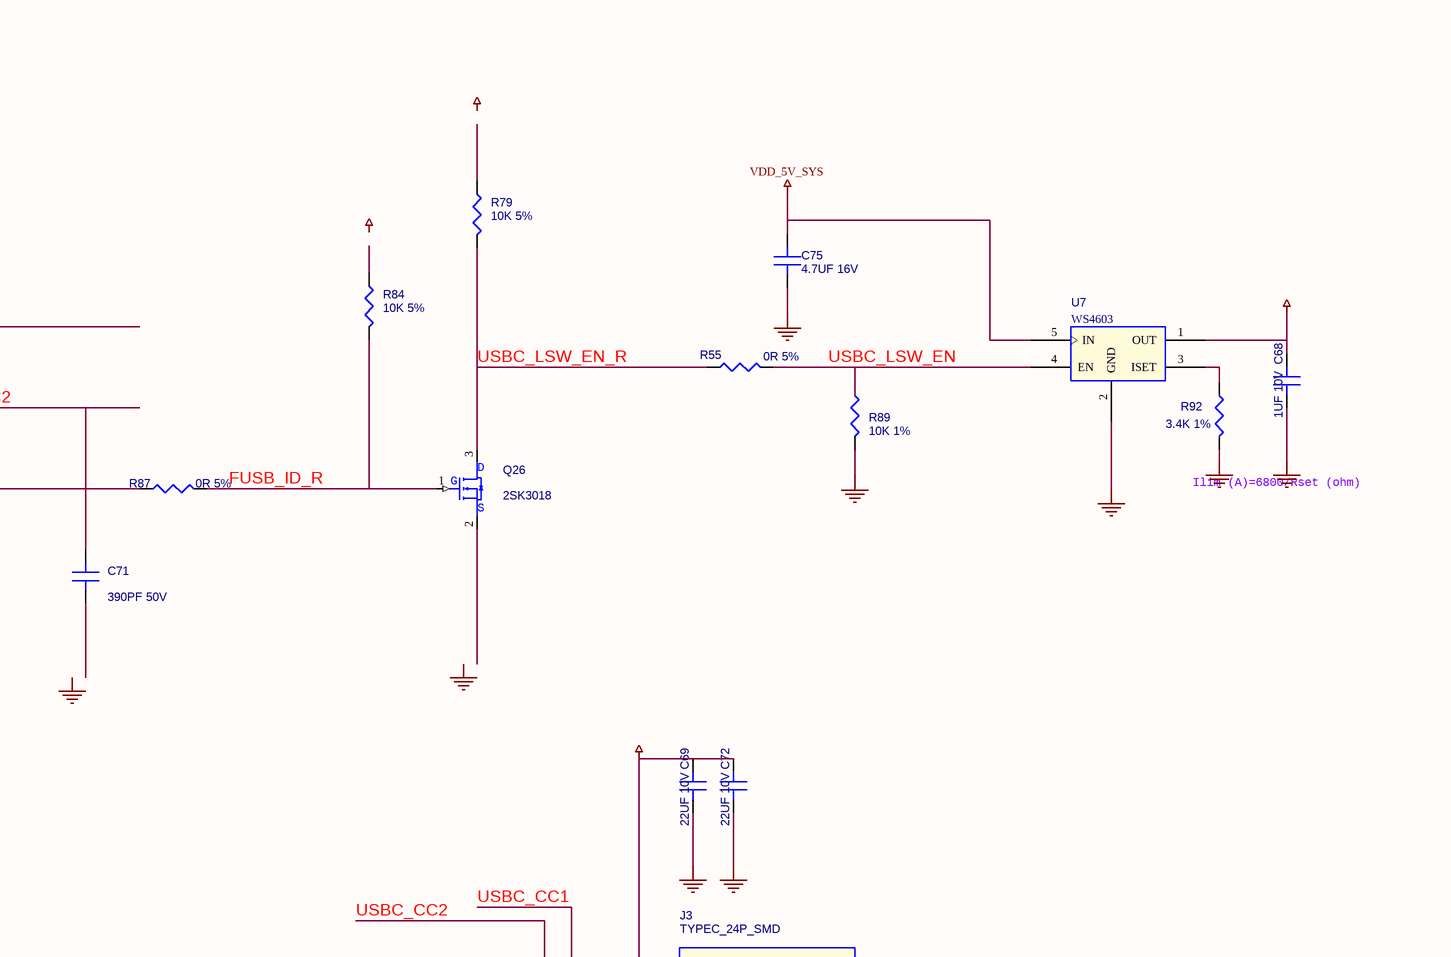
[diagram p20: 10_TYPE_C.SchDoc, top right]
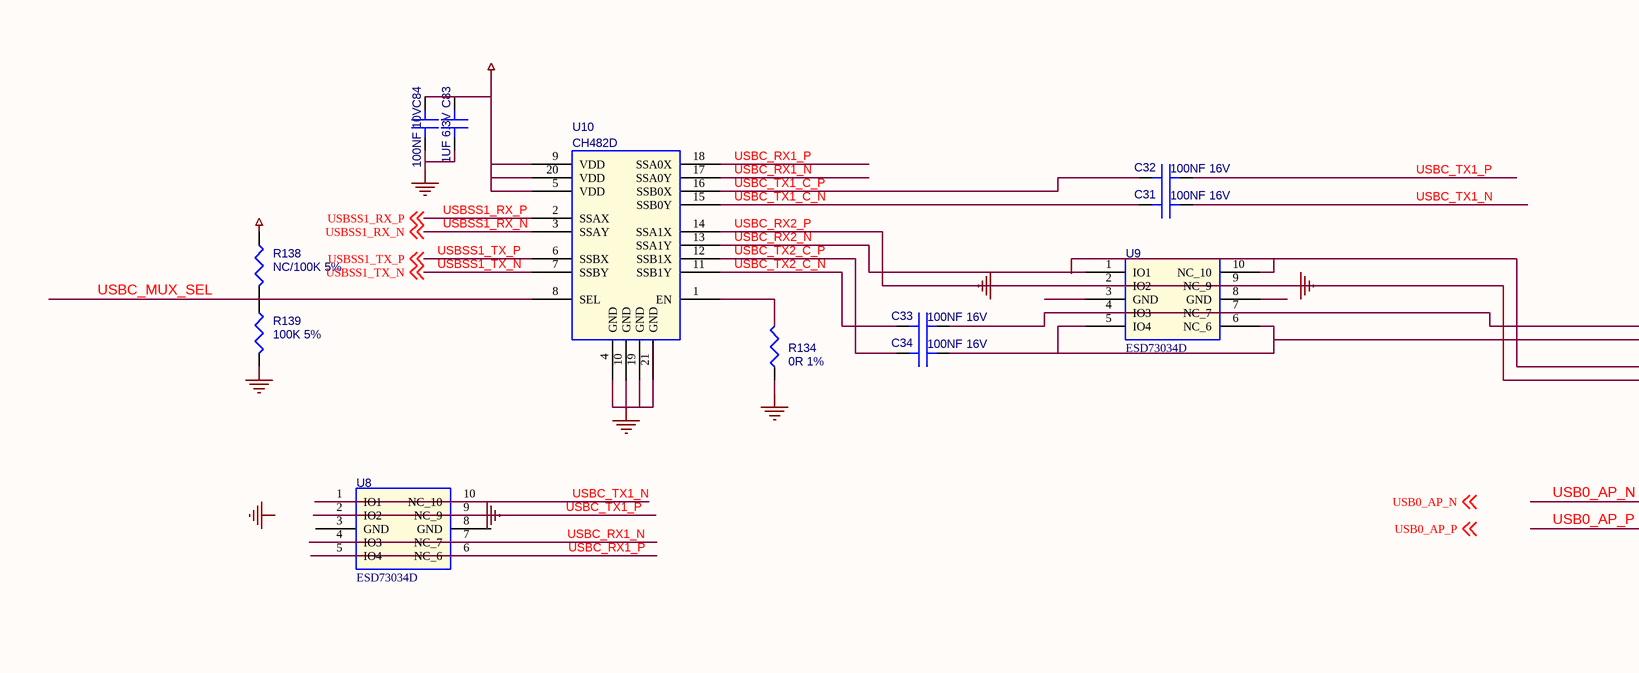
[diagram p21: 10_TYPE_C.SchDoc, bottom left]
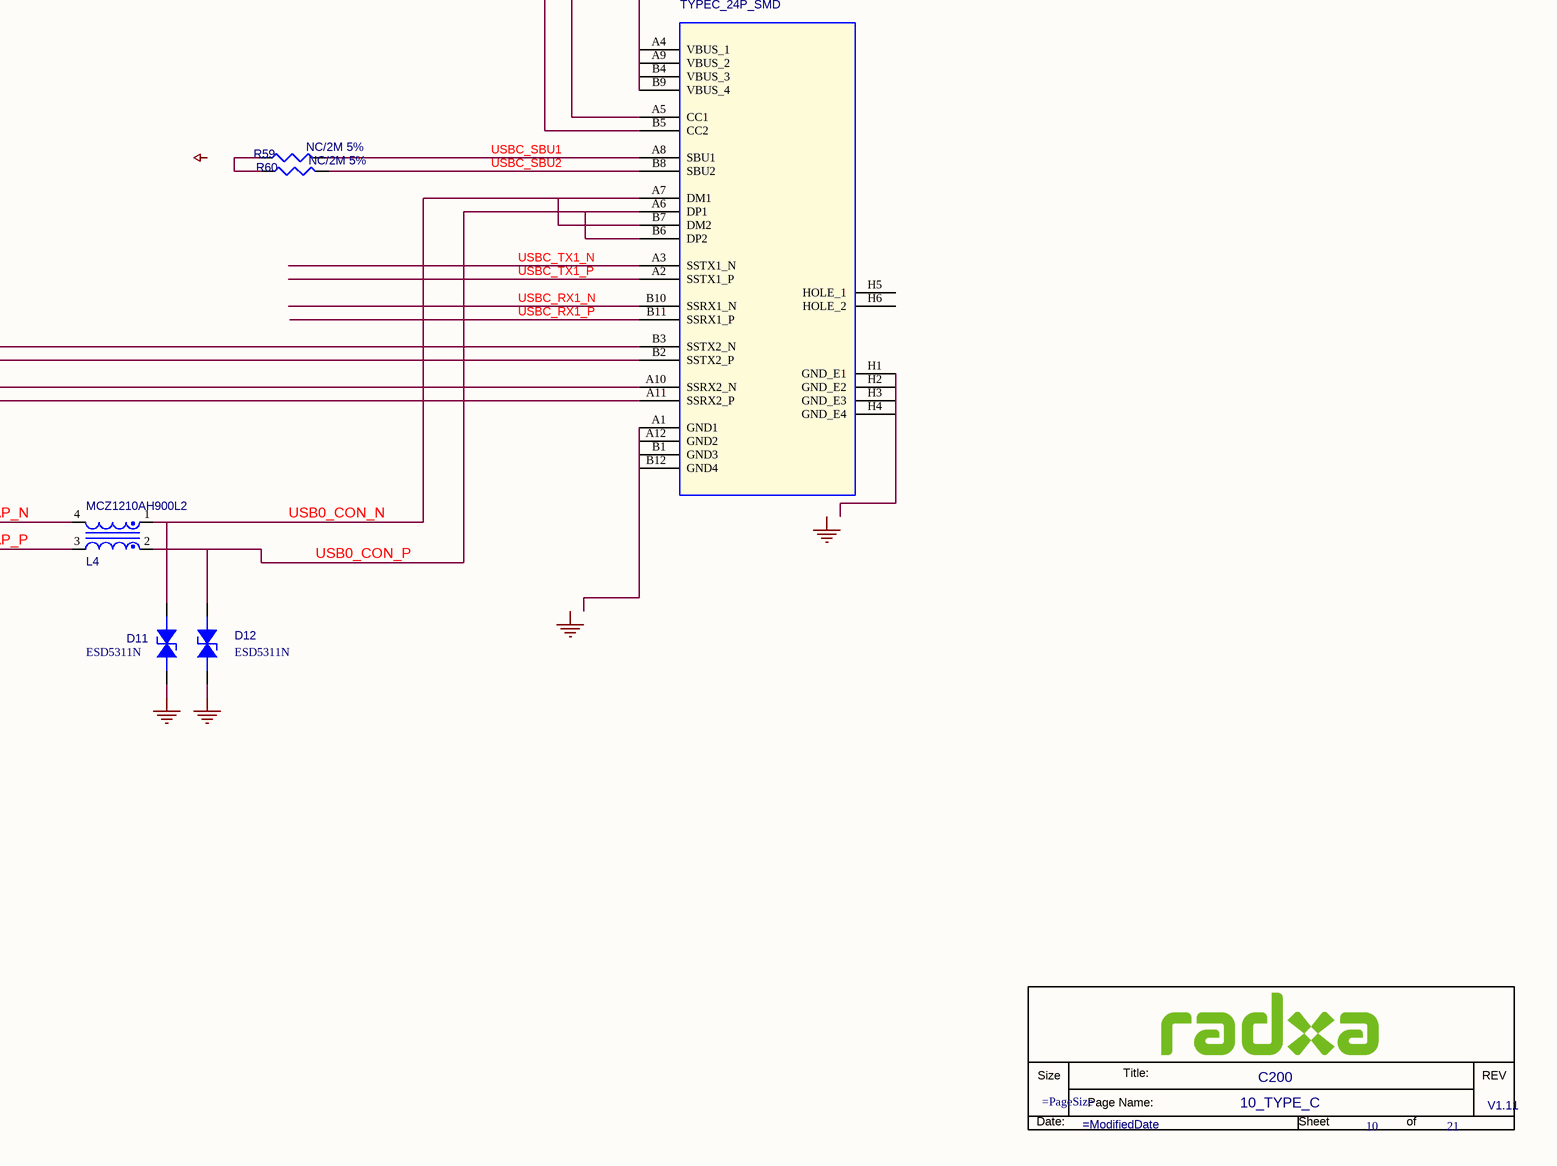
[diagram p22: 10_TYPE_C.SchDoc, bottom right]

### Parts
(Parts that share a designator on the sheet are numbered #1, #2 ... from top to bottom, then left to right.)
*#9  Doc: 10_TYPE_C  RevCode: V1.11  Title: C200  Page Number: 10  Page Count: 21  (hidden comment: radxa_1010)  (graphical)
C31  100NF 16V  [C0201]
C32  100NF 16V  [C0201]
C33  100NF 16V  [C0201]
C34  100NF 16V  [C0201]
C66  4.7UF 6.3V  [C0402]
C67  390PF 50V  [C0201]
C68  1UF 10V  [C0402]
C69  22UF 10V  [C0603]
C71  390PF 50V  [C0201]
C72  22UF 10V  [C0603]
C75  4.7UF 16V  [C0603]
C83  1UF 6.3V  [C0201]
C84  100NF 10V  [C0201]
C92  100NF 16V  [C0201]
D11  ESD5311N  [DFN1006-2L]
D12  ESD5311N  [DFN1006-2L]
J3  TYPEC_24P_SMD  [TYPEC_SM24_0D5_LIE]
L4  MCZ1210AH900L2  [LC1210]
Q26  2SK3018  [SOT_323]
R55  0R 5%  [R0402]
R59  NC/2M 5%  [R0402]
R60  NC/2M 5%  [R0402]
R79  10K 5%  [R0402]
R84  10K 5%  [R0402]
R85  0R 5%  [R0402]
R86  0R 5%  [R0402]
R87  0R 5%  [R0402]
R88  0R 5%  [R0402]
R89  10K 1%  [R0402]
R92  3.4K 1%  [R0402]
R126  47K 5%  [R0402]
R134  0R 1%  [R0402]
R138  NC/100K 5%  [R0402]
R139  100K 5%  [R0402]
U2  SKU: COMMON  [TMLP_0D4_1D2]  (hidden comment: U_USB_FUSB301)
U7  WS4603  [SOT23_5]
U8  ESD73034D  [XSON10_0D5_1D1X2D6]
U9  ESD73034D  [XSON10_0D5_1D1X2D6]
U10  CH482D  [QFN20_0D5_2D5]

### Nets
GND: C32.2(B) C68.2(B) C69.2(B) C72.2(B) C75.2(B) C83.2(B) C84.2(B) D11.1(ANODE) D12.1(ANODE) J3.A2(SSTX1_P) J3.A11(SSRX2_P) R89.2 R92.1 R134.1 R139.2 U7.2(GND) U8.2(IO2) U8.9(NC_9) U9.2(IO2) U9.9(NC_9) U10.4(GND) U10.10(GND) U10.14(SSA1X) U10.19(GND) U10.21(GND)  [also labelled USBC_RX2_P, USBC_TX1_P]  [project net HUB2_SSTX_N_J25]
USBC_VBUS: C66.1(A) C68.1(A) C69.1(A) C72.1(A) J3.A4(VBUS_1) J3.A9(VBUS_2) J3.B4(VBUS_3) J3.B9(VBUS_4) U2.8(VBUS) U7.1(OUT)
VDD_3V3_SYS: C83.1(A) C84.1(A) R138.1 U10.5(VDD) U10.9(VDD) U10.20(VDD)  [project net 3V3]
VDD_5V_SYS: C75.1(A) U7.5(IN)  [project net PC_LED+]
FUSB_ID: R87.1 U2.3(ID)
FUSB_ID_R: Q26.1(G) R84.2 R87.2
FUSB_INT_N: R85.2 U2.10(INT_N)
FUSB_SCL: R86.2 U2.2(SCL)
FUSB_SDA: R88.2 U2.1(SDA)
ID_I2C_SCL: R86.1 ; off-sheet ID_I2C_SCL
ID_I2C_SDA: R88.1 ; off-sheet ID_I2C_SDA
USB0_AP_N: L4.4 ; off-sheet USB0_AP_N
USB0_AP_P: L4.3 ; off-sheet USB0_AP_P
USB0_CON_N: D11.2(CATHODE) J3.A7(DM1) J3.B7(DM2) L4.1
USB0_CON_P: D12.2(CATHODE) J3.A6(DP1) J3.B6(DP2) L4.2
USB0_VBUS_DET*: R85.1 R126.2 ; off-sheet USB0_VBUS_DET*
USBC_CC1: C67.1(A) J3.A5(CC1) U2.6(CC1)
USBC_CC2: C71.1(A) J3.B5(CC2) U2.7(CC2)
USBC_LSW_EN: R55.2 R89.1 U7.4(EN)
USBC_LSW_EN_R: Q26.3(D) R55.1 R79.2
USBC_MUX_SEL: R138.2 R139.1 U2.9(SS_SW) U10.8(SEL)
USBC_RX1_N: J3.B10(SSRX1_N) U8.4(IO3) U8.7(NC_7) U10.17(SSA0Y)
USBC_RX1_P: J3.B11(SSRX1_P) U8.5(IO4) U8.6(NC_6) U10.18(SSA0X)
USBC_RX2_N: J3.A10(SSRX2_N) U9.1(IO1) U9.10(NC_10) U10.13(SSA1Y)
USBC_SBU1: J3.A8(SBU1) R59.2
USBC_SBU2: J3.B8(SBU2) R60.2
USBC_TX1_C_N: C31.1(A) U10.15(SSB0Y)
USBC_TX1_C_P: C32.1(A) U10.16(SSB0X)
USBC_TX1_N: C31.2(B) J3.A3(SSTX1_N) U8.1(IO1) U8.10(NC_10)
USBC_TX2_C_N: C33.1(A) U10.11(SSB1Y)
USBC_TX2_C_P: C34.1(A) U10.12(SSB1X)
USBSS1_RX_N: U10.3(SSAY) ; off-sheet USBSS1_RX_N
USBSS1_RX_P: U10.2(SSAX) ; off-sheet USBSS1_RX_P
USBSS1_TX_N: U10.7(SSBY) ; off-sheet USBSS1_TX_N
USBSS1_TX_P: U10.6(SSBX) ; off-sheet USBSS1_TX_P
NetC33_2: C33.2(B) J3.B3(SSTX2_N) U9.4(IO3) U9.7(NC_7)
NetC34_2: C34.2(B) J3.B2(SSTX2_P) U9.5(IO4) U9.6(NC_6)
NetC92_1: C92.1(A) U2.5(VDD)
NetJ3_A1: J3.A1(GND1) J3.A12(GND2) J3.B1(GND3) J3.B12(GND4)
NetJ3_H1: J3.H1(GND_E1) J3.H2(GND_E2) J3.H3(GND_E3) J3.H4(GND_E4)
NetR59_1: R59.1 R60.1
NetR92_2: R92.2 U7.3(ISET)
NetR134_2: R134.2 U10.1(EN)

Not connected (* = marked no-connect by the designer): C66 2(B); C67 2(B); C71 2(B); C92 2(B); J3 H5(HOLE_1) H6(HOLE_2); Q26 2(S); R79 1; R84 1; R126 1; U2 4(GND); U8 3(GND) 8(GND); U9 3(GND) 8(GND)

### Notes on the sheet
- TYPE-C OTG
- (near R92) Ilim (A)=6800/Rset (ohm)
- I2CADDR:7'h25
- Labels drawn without touching a wire or pin: GND, ID_I2C_SCL, ID_I2C_SDA, USB0_AP_N, USB0_AP_P, USB0_VBUS_DET*, VDD_1V8, VDD_3V3_SYS
- (in symbol radxa_1010) Size; Title:; REV; Page Name:; Date:; Sheet; of

### Library data of the parts
C31 = C: SMD  0201  100NF  16V  X5R  ±20%  ROHS; PARTS: 1; Part Reference: C31; Part Number: A1C01.00099; OriginalSymbolOrigin: (0,30); PKG_TYPE: CAP2-100-250; LEVEL: STD; PINSWAP: (A,B); Value: 100NF 16V; Part Type: 陶瓷电容; PCB Footprint: C0201
C32 = C: SMD  0201  100NF  16V  X5R  ±20%  ROHS; PARTS: 1; Part Reference: C32; Part Number: A1C01.00099; OriginalSymbolOrigin: (0,30); PKG_TYPE: CAP2-100-250; LEVEL: STD; PINSWAP: (A,B); Value: 100NF 16V; Part Type: 陶瓷电容; PCB Footprint: C0201
C33 = C: SMD  0201  100NF  16V  X5R  ±20%  ROHS; PARTS: 1; Part Reference: C33; Part Number: A1C01.00099; OriginalSymbolOrigin: (0,30); PKG_TYPE: CAP2-100-250; LEVEL: STD; PINSWAP: (A,B); Value: 100NF 16V; Part Type: 陶瓷电容; PCB Footprint: C0201
C34 = C: SMD  0201  100NF  16V  X5R  ±20%  ROHS; PARTS: 1; Part Reference: C34; Part Number: A1C01.00099; OriginalSymbolOrigin: (0,30); PKG_TYPE: CAP2-100-250; LEVEL: STD; PINSWAP: (A,B); Value: 100NF 16V; Part Type: 陶瓷电容; PCB Footprint: C0201
C66 = C: SMD  0402  4.7UF  6.3V  X5R  ±20%  ROHS; PARTS: 1; Part Reference: C66; Part Number: A1C01.00007; OriginalSymbolOrigin: (0,30); PKG_TYPE: CAP2-100-250; LEVEL: STD; PINSWAP: (A,B); Value: 4.7UF 6.3V; Part Type: 陶瓷电容; PCB Footprint: C0402
C67 = C: SMD  0201  390PF  50V  X7R  ±10%  ROHS; PARTS: 1; Part Reference: C67; Part Number: A1C01.00134; OriginalSymbolOrigin: (0,30); PKG_TYPE: CAP2-100-250; LEVEL: STD; PINSWAP: (A,B); Value: 390PF 50V; Part Type: 陶瓷电容; PCB Footprint: C0201
C68 = C: SMD  0402  1UF  10V  X5R  ±20%  ROHS; PARTS: 1; Part Reference: C68; Part Number: A1C01.00148; OriginalSymbolOrigin: (0,30); PKG_TYPE: CAP2-100-250; LEVEL: STD; PINSWAP: (A,B); Value: 1UF 10V; Part Type: 陶瓷电容; PCB Footprint: C0402
C69 = C: SMD  0603  22UF  10V  X5R  ±20%  ROHS; PARTS: 1; Part Reference: C69; Part Number: A1C01.00015; OriginalSymbolOrigin: (0,30); PKG_TYPE: CAP2-100-250; LEVEL: STD; PINSWAP: (A,B); Value: 22UF 10V; Part Type: 陶瓷电容; PCB Footprint: C0603
C71 = C: SMD  0201  390PF  50V  X7R  ±10%  ROHS; PARTS: 1; Part Reference: C71; Part Number: A1C01.00134; OriginalSymbolOrigin: (0,30); PKG_TYPE: CAP2-100-250; LEVEL: STD; PINSWAP: (A,B); Value: 390PF 50V; Part Type: 陶瓷电容; PCB Footprint: C0201
C72 = C: SMD  0603  22UF  10V  X5R  ±20%  ROHS; PARTS: 1; Part Reference: C72; Part Number: A1C01.00015; OriginalSymbolOrigin: (0,30); PKG_TYPE: CAP2-100-250; LEVEL: STD; PINSWAP: (A,B); Value: 22UF 10V; Part Type: 陶瓷电容; PCB Footprint: C0603
C75 = C: SMD  0603  4.7UF  16V  X5R  ±10%  ROHS; PARTS: 1; Part Reference: C75; Part Number: A1C01.00239; OriginalSymbolOrigin: (0,30); PKG_TYPE: CAP2-100-250; LEVEL: STD; PINSWAP: (A,B); Value: 4.7UF 16V; Part Type: 陶瓷电容; PCB Footprint: C0603
C83 = C: SMD  0201  1UF  6.3V  X5R  ±20%  ROHS; PARTS: 1; Part Reference: C83; Part Number: A1C01.00083; OriginalSymbolOrigin: (0,30); PKG_TYPE: CAP2-100-250; LEVEL: STD; PINSWAP: (A,B); Value: 1UF 6.3V; Part Type: 陶瓷电容; PCB Footprint: C0201
C84 = C: SMD  0201  100NF  10V  X5R  ±10%  ROHS; PARTS: 1; Part Reference: C84; Part Number: A1C01.00097; OriginalSymbolOrigin: (0,30); PKG_TYPE: CAP2-100-250; LEVEL: STD; PINSWAP: (A,B); Value: 100NF 10V; Part Type: 陶瓷电容; PCB Footprint: C0201
C92 = C: SMD  0201  100NF  16V  X5R  ±10%  ROHS; PARTS: 1; Part Reference: C92; Part Number: A1C01.00018; OriginalSymbolOrigin: (0,30); PKG_TYPE: CAP2-100-250; LEVEL: STD; PINSWAP: (A,B); Value: 100NF 16V; Part Type: 陶瓷电容; PCB Footprint: C0201
D11 = ESD: SMD  编带  DFN1006-2L  ESD5311N-2/TR  双向TVS  VRWM=5V  0.25pF  84W  WILLSEMI(韦尔)  ROHS; Part Reference: D11; Part Number: A1D02.00001; Parameter: ESD-台舟 ESD5341N-封装 esd0402; ID: DE-E0004; Value: ESD5311N; Part Type: 二极管-ESD管-桥堆-TVS管; PCB Footprint: DFN1006-2L
D12 = ESD: SMD  编带  DFN1006-2L  ESD5311N-2/TR  双向TVS  VRWM=5V  0.25pF  84W  WILLSEMI(韦尔)  ROHS; Part Reference: D12; Part Number: A1D02.00001; Parameter: ESD-台舟 ESD5341N-封装 esd0402; ID: DE-E0004; Value: ESD5311N; Part Type: 二极管-ESD管-桥堆-TVS管; PCB Footprint: DFN1006-2L
J3 = TYPEC_24P_SMD: Part Reference: J3; PCB Footprint: TYPEC_SM24_0D5_LIE; Value: TYPEC_24P_SMD
L4 = MCZ1210AH900L2: SMD  MCZ1210AH900L2TA0G  90R  4PIN  TDK  ROHS; Part Reference: L4; Part Number: A1L03.00007; PCB Footprint: LC1210; Value: MCZ1210AH900L2; Part Type: 共模电感
Q26 = MOSFET_NPN: SMD  编带  SOT-323  2SK3018  N沟道  长晶  ROHS; Part Reference: Q26; Part Number: A1D01.00007; Temp Coeff: -55℃ to ＋150℃; Value: 2SK3018; Part Type: 三极管-MOS管; PCB Footprint: SOT_323
R55 = R: SMD  0201  0R  1/20W  ±5%  ROHS; Part Reference: R55; Part Number: A1R01.00027; PCB Footprint: R0201; Temp Coeff: －55℃ ~ ＋125℃; Value: 0R 5%; Part Type: 贴片电阻
R59 = R: SMD  0201  2M  1/20W  ±5%  ROHS; Part Reference: R59; Part Number: A1R01.00114; PCB Footprint: R0201; Value: NC/2M 5%; Part Type: 贴片电阻
R60 = R: SMD  0201  2M  1/20W  ±5%  ROHS; Part Reference: R60; Part Number: A1R01.00114; PCB Footprint: R0201; Value: NC/2M 5%; Part Type: 贴片电阻
R79 = R: SMD  0201  10K  1/20W  ±5%  ROHS; Part Reference: R79; Part Number: A1R01.00012; PCB Footprint: R0201; Temp Coeff: －55℃ ~ ＋125℃; Value: 10K 5%; Part Type: 贴片电阻
R84 = R: SMD  0201  10K  1/20W  ±5%  ROHS; Part Reference: R84; Part Number: A1R01.00012; PCB Footprint: R0201; Temp Coeff: －55℃ ~ ＋125℃; Value: 10K 5%; Part Type: 贴片电阻
R85 = R: SMD  0201  0R  1/20W  ±5%  ROHS; Part Reference: R85; Part Number: A1R01.00027; PCB Footprint: R0201; Temp Coeff: －55℃ ~ ＋125℃; Value: 0R 5%; Part Type: 贴片电阻
R86 = R: SMD  0201  0R  1/20W  ±5%  ROHS; Part Reference: R86; Part Number: A1R01.00027; PCB Footprint: R0201; Temp Coeff: －55℃ ~ ＋125℃; Value: 0R 5%; Part Type: 贴片电阻
R87 = R: SMD  0201  0R  1/20W  ±5%  ROHS; Part Reference: R87; Part Number: A1R01.00027; PCB Footprint: R0201; Temp Coeff: －55℃ ~ ＋125℃; Value: 0R 5%; Part Type: 贴片电阻
R88 = R: SMD  0201  0R  1/20W  ±5%  ROHS; Part Reference: R88; Part Number: A1R01.00027; PCB Footprint: R0201; Temp Coeff: －55℃ ~ ＋125℃; Value: 0R 5%; Part Type: 贴片电阻
R89 = R: SMD  0402  10K  1/16W  ±1%  ROHS; Part Reference: R89; CDS_PHYS_PART_NAME: R_0402-10K,5 %,62.5MW,195-0486-000-10K,195-0486-000; CDS_PART_NAME: R_0402-10K,5 %,62.5MW,195-0486-000; Part Number: A1R01.00222; SEC: 1; XY: (-7750,6150); VER: 2; TOL: 5%; SIGNAL_MODEL: nv_res; ROT: 0; PHYS_PAGE: 14; PATH: I42; PACK_TYPE: 402; NV_PN: 195-0486-000; MAX_WATTAGE: 62.5mW; DRAWING: #NAME?; DEVICE_TYPENAME: R_0402-10K5625MW195-0486-000-10K195-0486-000; CDS_LIB: discrete; ASSEMBLY: USB3_TYPEA; PCB Footprint: R0402; Value: 10K 1%; CHIPS_PART_NAME: R; CDS_SEC: 1; Part Type: 贴片电阻
R92 = R: SMD  0402  3.4K  1/16W  ±1%  ROHS; Part Reference: R92; Part Number: A1R01.00506; PCB Footprint: R0402; Value: 3.4K 1%; Part Type: 贴片电阻
R126 = R: SMD  0402  47K  1/16W  ±5%  ROHS; Part Reference: R126; Part Number: A1R01.00053; Temp Coeff: －55℃ ~ ＋155℃; PCB Footprint: R0402; Value: 47K 5%; Part Type: 贴片电阻
R134 = R: SMD  0402  0R  1/16W  ±1%  ROHS; Part Reference: R134; CDS_PHYS_PART_NAME: R_0402-10K,5 %,62.5MW,195-0486-000-10K,195-0486-000; CDS_PART_NAME: R_0402-10K,5 %,62.5MW,195-0486-000; Part Number: A1R01.00219; SEC: 1; XY: (-10850,1350); VER: 2; TOL: 5%; SIGNAL_MODEL: nv_res; ROT: 0; PHYS_PAGE: 18; PATH: I92; PACK_TYPE: 402; NV_PN: 195-0486-000; MAX_WATTAGE: 62.5mW; DRAWING: @P3449_B01_LIB.P3449_B01(SCH_1):PAGE18; DEVICE_TYPENAME: R_0402-10K5625MW195-0486-000-10K195-0486-000; CDS_LIB: discrete; ASSEMBLY: CAM; PCB Footprint: R0402; Value: 0R 1%; CHIPS_PART_NAME: R; CDS_SEC: 1; Part Type: 贴片电阻
R138 = R: SMD  0201  100K  1/20W  ±5%  ROHS; Part Reference: R138; Part Number: A1R01.00006; PCB Footprint: R0201; Value: NC/100K 5%; Part Type: 贴片电阻
R139 = R: SMD  0201  100K  1/20W  ±5%  ROHS; Part Reference: R139; Part Number: A1R01.00006; PCB Footprint: R0201; Value: 100K 5%; Part Type: 贴片电阻
U2 = FUSB301TMX: Part Reference: U2; OriginalSymbolOrigin: (-325,400); ASSEMBLY: ?; NV_NAME: ?; NV_PN: ?; PACK_TYPE: FUSB301TMX; PATH: ?; PLACEMENT_NOTE: ?; TYPE: ?; Value: U_USB_FUSB301; PCB Footprint: TMLP_0D4_1D2
U7 = WS4603: SMD  功率开关  WS4603E-5/TR  1.25H  SOT-23-5L  ROHS; Part Reference: U7; Part Number: A1I01.00241; Parameter: SOT23-5; ID: U-IC0020; Temp Coeff: -40℃ to 85℃; Value: WS4603; Part Type: 集成电路/模块; PCB Footprint: SOT23_5
U8 = ESD73034D: SMD  编带  SON10  ESD73034D-10/TR  4Line 双向TVS  VRWM=3.3V  0.2pF  33W  WILLSEMI(韦尔)  ROHS; Part Reference: U8; Part Number: A1D02.00015; Parameter: ESD-ESD73034D-封装 SON10_2R50X1R00X0R50; PCB Footprint: XSON10_0D5_1D1X2D6; Value: ESD73034D; Part Type: 二极管-ESD管-桥堆-TVS管
U9 = ESD73034D: SMD  编带  SON10  ESD73034D-10/TR  4Line 双向TVS  VRWM=3.3V  0.2pF  33W  WILLSEMI(韦尔)  ROHS; Part Reference: U9; Part Number: A1D02.00015; Parameter: ESD-ESD73034D-封装 SON10_2R50X1R00X0R50; PCB Footprint: XSON10_0D5_1D1X2D6; Value: ESD73034D; Part Type: 二极管-ESD管-桥堆-TVS管
U10 = CH482D: SMD  USB3.0  CH482D  QFN20  沁恒  ROHS; Part Reference: U10; Part Number: A1I01.00036; Value: CH482D; Part Type: 集成电路/模块; PCB Footprint: QFN20_0D5_2D5
*#9 = radxa_1010: Page Create Date: March  8, 1995; Page Size: =PageSize; Page Modify Date: =ModifiedDate